# Altium schematic sheet Sheet_1_2021-12-20.schdoc
size 49 x 29 mm
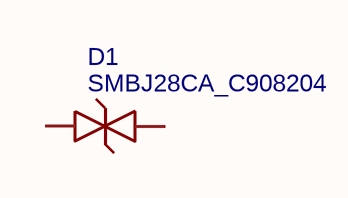
[diagram p0: Sheet_1_2021-12-20.schdoc]

## Parts
D1  SMBJ28CA_C908204  [SMB_L4.6-W3.6-LS5.3-BI]

## Nets

Not connected (* = marked no-connect by the designer): D1 1 2

## Library data of the parts
D1 = SMBJ28CA_C908204: BOM_Manufacturer: FUXINSEMI; Contributor: LCSC; BOM_Supplier: LCSC; BOM_Supplier Part: C908204; BOM_Manufacturer Part: SMBJ28CA; BOM_JLCPCB Part Class: Extended Part; spicePre: D; spiceSymbolName: SMBJ28CA_C908204